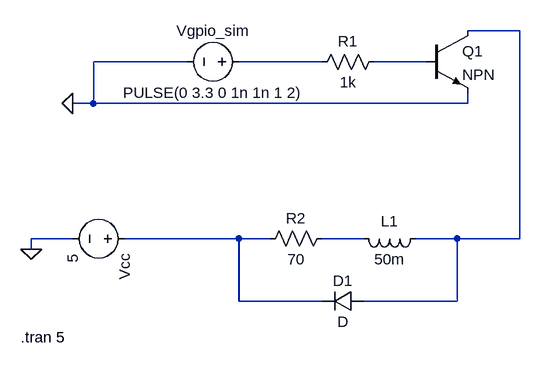
[diagram p0: schematic ltspice_simulation.asc]
ltspice_simulation.asc, the LTspice schematic file:
Version 4.1
SHEET 1 1096 680
WIRE 544 -416 464 -416
WIRE 32 -368 -112 -368
WIRE 240 -368 112 -368
WIRE 400 -368 320 -368
WIRE -112 -304 -112 -368
WIRE -112 -304 -144 -304
WIRE 464 -304 464 -320
WIRE 464 -304 -112 -304
WIRE -144 -96 -208 -96
WIRE 112 -96 -64 -96
WIRE 160 -96 112 -96
WIRE 304 -96 240 -96
WIRE 448 -96 384 -96
WIRE 544 -96 544 -416
WIRE 544 -96 448 -96
WIRE -208 -80 -208 -96
WIRE 112 0 112 -96
WIRE 240 0 112 0
WIRE 448 0 448 -96
WIRE 448 0 304 0
FLAG -144 -304 0
FLAG -208 -80 0
SYMBOL voltage -48 -96 R90
WINDOW 123 0 0 Left 0
WINDOW 39 0 0 Left 0
SYMATTR InstName Vcc
SYMATTR Value 5
SYMBOL voltage 128 -368 R90
WINDOW 0 -32 56 VBottom 2
WINDOW 3 32 56 VTop 2
WINDOW 123 0 0 Left 0
WINDOW 39 0 0 Left 0
SYMATTR InstName Vgpio_sim
SYMATTR Value PULSE(0 3.3 0 1n 1n 1 2)
SYMBOL res 336 -384 R90
WINDOW 0 0 56 VBottom 2
WINDOW 3 32 56 VTop 2
SYMATTR InstName R1
SYMATTR Value 1k
SYMBOL npn 400 -416 R0
SYMATTR InstName Q1
SYMBOL ind 400 -112 R90
WINDOW 0 5 56 VBottom 2
WINDOW 3 32 56 VTop 2
SYMATTR InstName L1
SYMATTR Value 50m
SYMATTR SpiceLine Rser=1m
SYMBOL res 256 -112 R90
WINDOW 0 0 56 VBottom 2
WINDOW 3 32 56 VTop 2
SYMATTR InstName R2
SYMATTR Value 70
SYMBOL diode 304 -16 R90
WINDOW 0 0 32 VBottom 2
WINDOW 3 32 32 VTop 2
SYMATTR InstName D1
TEXT -224 56 Left 2 !.tran 5

The netlist it stands for:
* ltspice_simulation.asc
Vcc N004 0 5
Vgpio_sim N002 0 PULSE(0 3.3 0 1n 1n 1 2)
R1 N003 N002 1k
Q1 N001 N003 0 0 NPN
L1 N001 N005 50m Rser=1m
R2 N005 N004 70
D1 N001 N004 D
.model D D
.lib standard.dio
.model NPN NPN
.model PNP PNP
.lib standard.bjt
.tran 5
.backanno
.end